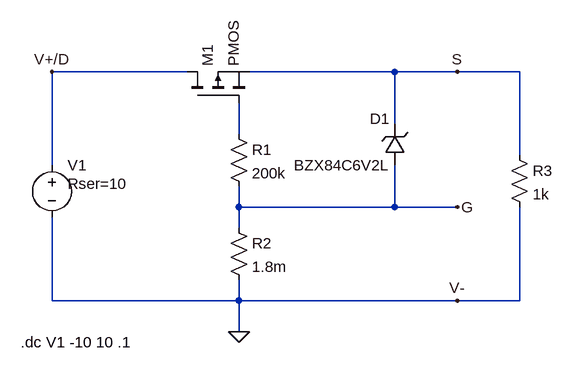
[diagram p0: schematic ReverseVoltageProtection.asc]
ReverseVoltageProtection.asc, the LTspice schematic file:
Version 4
SHEET 1 880 680
WIRE 112 32 -96 32
WIRE 432 32 208 32
WIRE 528 32 432 32
WIRE 624 32 528 32
WIRE 432 112 432 32
WIRE 192 128 192 80
WIRE 624 160 624 32
WIRE -96 176 -96 32
WIRE 192 240 192 208
WIRE 432 240 432 176
WIRE 432 240 192 240
WIRE 528 240 432 240
WIRE 192 272 192 240
WIRE -96 384 -96 256
WIRE 192 384 192 352
WIRE 192 384 -96 384
WIRE 528 384 192 384
WIRE 624 384 624 240
WIRE 624 384 528 384
WIRE 192 432 192 384
FLAG 528 384 V-
FLAG 528 240 G
FLAG -96 32 V+/D
FLAG 528 32 S
FLAG 192 432 0
SYMBOL res 176 112 R0
SYMATTR InstName R1
SYMATTR Value 200k
SYMBOL res 176 256 R0
SYMATTR InstName R2
SYMATTR Value 1.8m
SYMBOL zener 448 176 R180
WINDOW 0 24 72 Left 0
WINDOW 3 24 0 Left 0
SYMATTR InstName D1
SYMATTR Value BZX84C6V2L
SYMBOL voltage -96 160 R0
WINDOW 123 0 0 Left 0
WINDOW 39 24 44 Left 0
SYMATTR SpiceLine Rser=10
SYMATTR InstName V1
SYMATTR Value ""
SYMBOL pmos 112 80 R270
SYMATTR InstName M1
SYMBOL res 608 144 R0
SYMATTR InstName R3
SYMATTR Value 1k
TEXT -144 448 Left 0 !.dc V1 -10 10 .1

The netlist it stands for:
* ReverseVoltageProtection.asc
R1 N001 G 200k
R2 G 0 1.8m
D1 G S BZX84C6V2L
V1 V+/D 0 Rser=10
M1 V+/D N001 S S PMOS
R3 S 0 1k
.model D D
.lib standard.dio
.model NMOS NMOS
.model PMOS PMOS
.lib standard.mos
.dc V1 -10 10 .1
.backanno
.end